# EAGLE design GBCART (EAGLE 6.4)
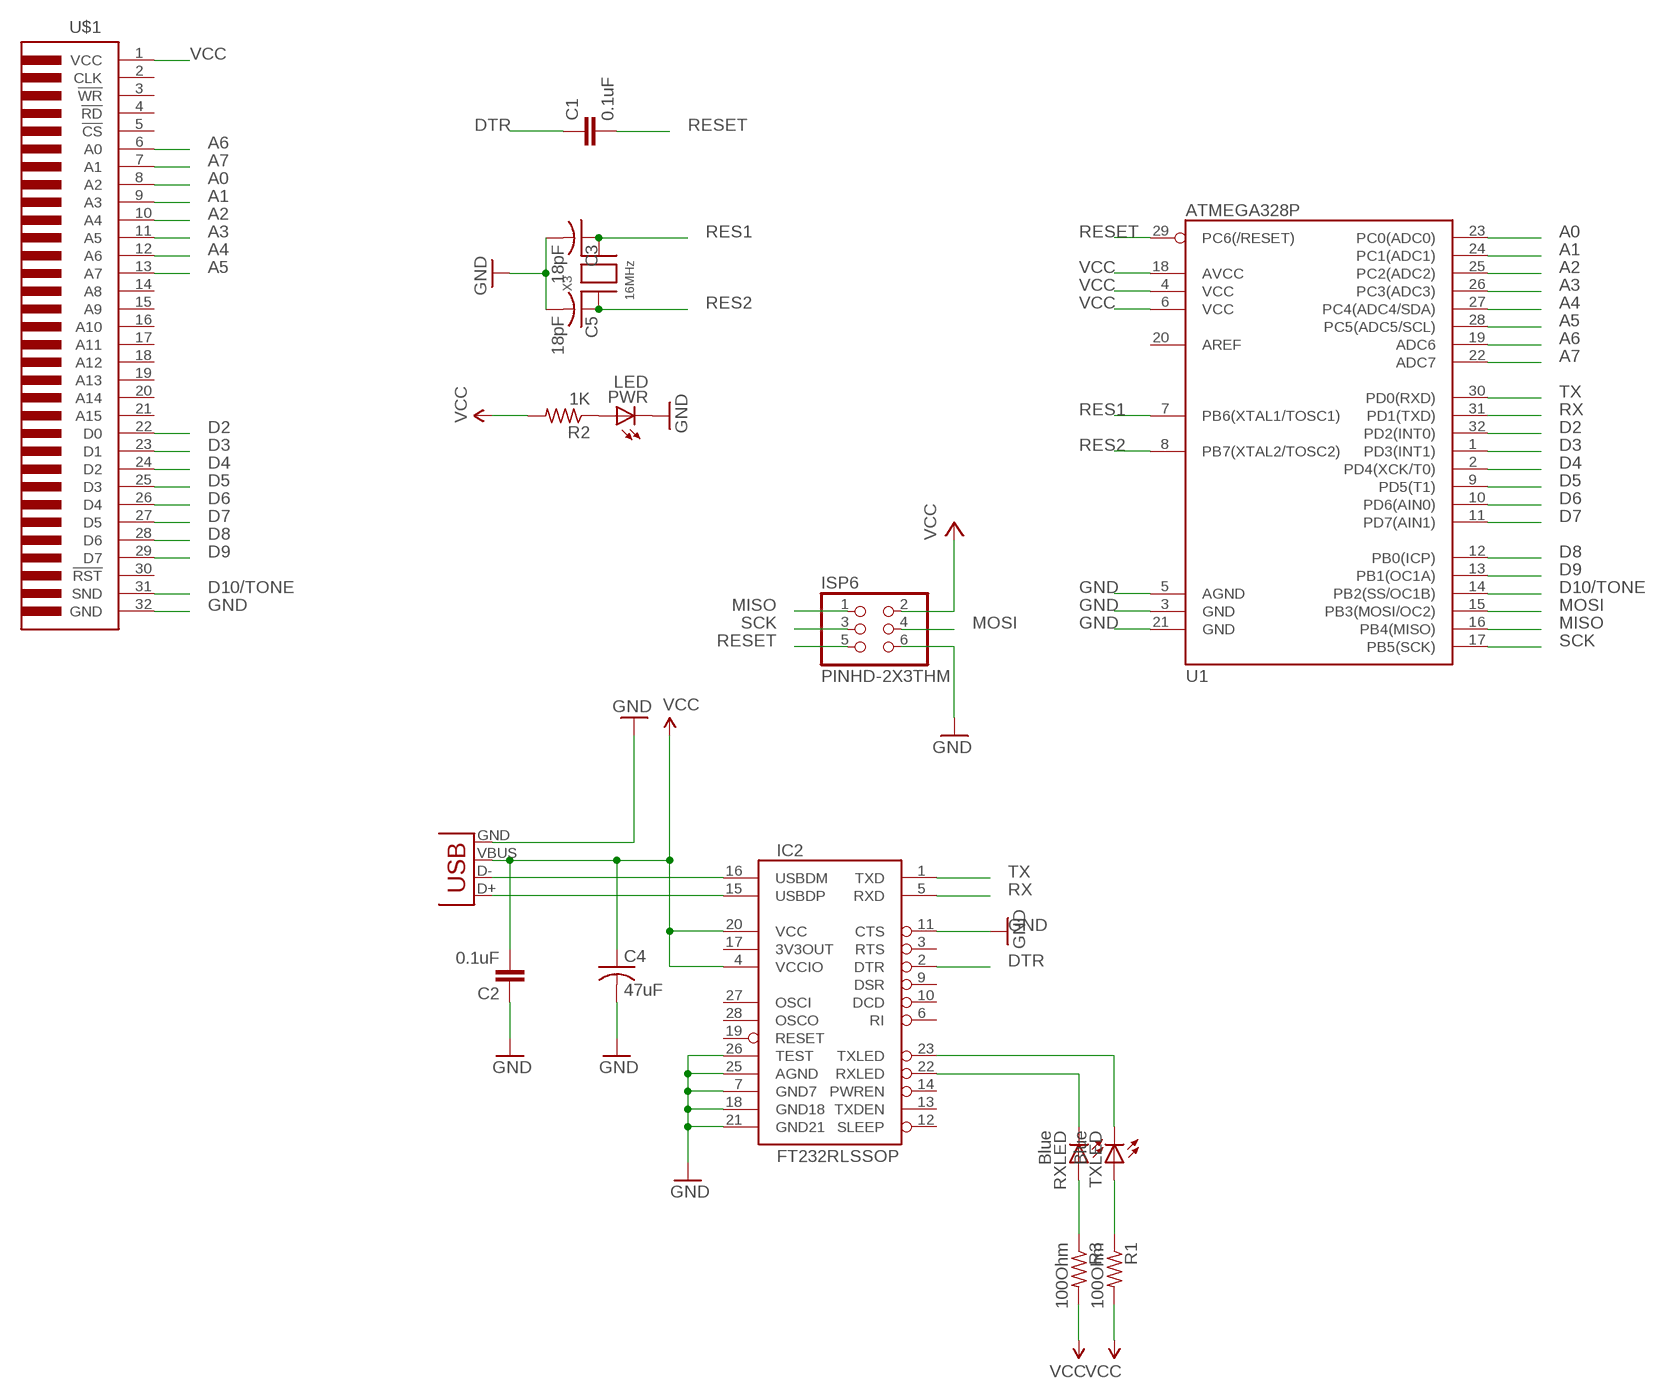
[diagram p0: schematic, sheet 1]

## Parts
C1  0.1uF  CAP0805  [0805]
C2  0.1uF  CAP0805  [0805]
C3  18pF  C-USC0805K  [C0805K]
C4  47uF  C-USC0805  [C0805]
C5  18pF  C-USC0805K  [C0805K]
IC2  FT232RLSSOP  [SSOP28DB]
ISP6  PINHD-2X3THM  [ISP6]
PWR  LED  LEDCHIPLED_0805  [CHIPLED_0805]
R1  100Ohm  R-US_R0805  [R0805]
R2  1K  R-US_R0805  [R0805]
R3  100Ohm  R-US_R0805  [R0805]
RXLED  Blue  LEDCHIPLED_0805  [CHIPLED_0805]
TXLED  Blue  LEDCHIPLED_0805  [CHIPLED_0805]
U1  ATMEGA328P  ATMEGA168  [TQFP32-08]
U$1  GBCART-FULL  [GBCART]
X1  USBSMD  [USB-MINIB]
X3  16MHz  XTALNX5032  [NX5032]

## Nets
A0: U1.23(PC0(ADC0)) U$1.8(A2)
A1: U1.24(PC1(ADC1)) U$1.9(A3)
A2: U1.25(PC2(ADC2)) U$1.10(A4)
A3: U1.26(PC3(ADC3)) U$1.11(A5)
A4: U1.27(PC4(ADC4/SDA)) U$1.12(A6)
A5: U1.28(PC5(ADC5/SCL)) U$1.13(A7)
A6: U1.19(ADC6) U$1.6(A0)
A7: U1.22(ADC7) U$1.7(A1)
D2: U1.32(PD2(INT0)) U$1.22(D0)
D3: U1.1(PD3(INT1)) U$1.23(D1)
D4: U1.2(PD4(XCK/T0)) U$1.24(D2)
D5: U1.9(PD5(T1)) U$1.25(D3)
D6: U1.10(PD6(AIN0)) U$1.26(D4)
D7: U1.11(PD7(AIN1)) U$1.27(D5)
D8: U1.12(PB0(ICP)) U$1.28(D6)
D9: U1.13(PB1(OC1A)) U$1.29(D7)
D10/TONE: U1.14(PB2(SS/OC1B)) U$1.31(SND)
D+: IC2.15(USBDP) X1.D+
D-: IC2.16(USBDM) X1.D-
DTR: C1.1 IC2.2(DTR)
GND: C2.1 C3.2 C4.2 C5.2 IC2.7(GND7) IC2.11(CTS) IC2.18(GND18) IC2.21(GND21) IC2.25(AGND) IC2.26(TEST) ISP6.6 PWR.C U1.3(GND) U1.5(AGND) U1.21(GND) U$1.32(GND) X1.GND
MISO: ISP6.1 U1.16(PB4(MISO))
MOSI: ISP6.4 U1.15(PB3(MOSI/OC2))
N$1: PWR.A R2.1
N$10: R3.1 RXLED.A
N$11: R1.1 TXLED.A
RES1: C3.1 U1.7(PB6(XTAL1/TOSC1)) X3.P$2
RES2: C5.1 U1.8(PB7(XTAL2/TOSC2)) X3.P$1
RESET: C1.2 ISP6.5 U1.29(PC6(/RESET))
RX: IC2.5(RXD) U1.31(PD1(TXD))
RXLED: IC2.22(RXLED) RXLED.C
SCK: ISP6.3 U1.17(PB5(SCK))
TX: IC2.1(TXD) U1.30(PD0(RXD))
TXLED: IC2.23(TXLED) TXLED.C
VCC: C2.2 C4.1 IC2.4(VCCIO) IC2.20(VCC) ISP6.2 R1.2 R2.2 R3.2 U1.4(VCC) U1.6(VCC) U1.18(AVCC) U$1.1(VCC) X1.VBUS
Unconnected: IC2.3(RTS) IC2.6(RI) IC2.9(DSR) IC2.10(DCD) IC2.12(SLEEP) IC2.13(TXDEN) IC2.14(PWREN) IC2.17(3V3OUT) IC2.19(RESET) IC2.27(OSCI) IC2.28(OSCO) U1.20(AREF) U$1.2(CLK) U$1.3(!WR) U$1.4(!RD) U$1.5(!CS) U$1.14(A8) U$1.15(A9) U$1.16(A10) U$1.17(A11) U$1.18(A12) U$1.19(A13) U$1.20(A14) U$1.21(A15) U$1.30(!RST)

## Library data of the parts
C1 C2 = SparkFun:CAP: Capacitor Standard 0603 ceramic capacitor, and 0.1" leaded capacitor.
C3 C5 = adafruit:C-US: CAPACITOR, American symbol
C4 = rcl:C-US: CAPACITOR, American symbol
IC2 = SparkFun:FT232RL: USB UART FT232RL 4th Generation USB UART (USB <-> Serial) Controller. Spark Fun Electronics SKU : COM-00650
ISP6 = adaprog:PINHD-2X3
PWR = adafruit:LED: LED
R1-R3 = adafruit:R-US_: RESISTOR, American symbol
RXLED TXLED = led:LED: LED
U1 = SparkFun:ATMEGA168
U$1 = gameboy:GBCART
X1 = SparkFun:USB: USB Connectors USB-B-PTH is fully proven SKU : PRT-00139 USB-miniB is fully proven SKU : PRT-00587 USB-A-PCB is untested. USB-A-H is throughly reviewed, but untested. Spark Fun Electronics SKU : PRT-00437 USB-B-SMT is throughly reviewed, but untested. Needs silkscreen touching up. USB-A-S has not been used/tested USB-MB-H has not been used/tested
X3 = adaprog:XTAL

## Board
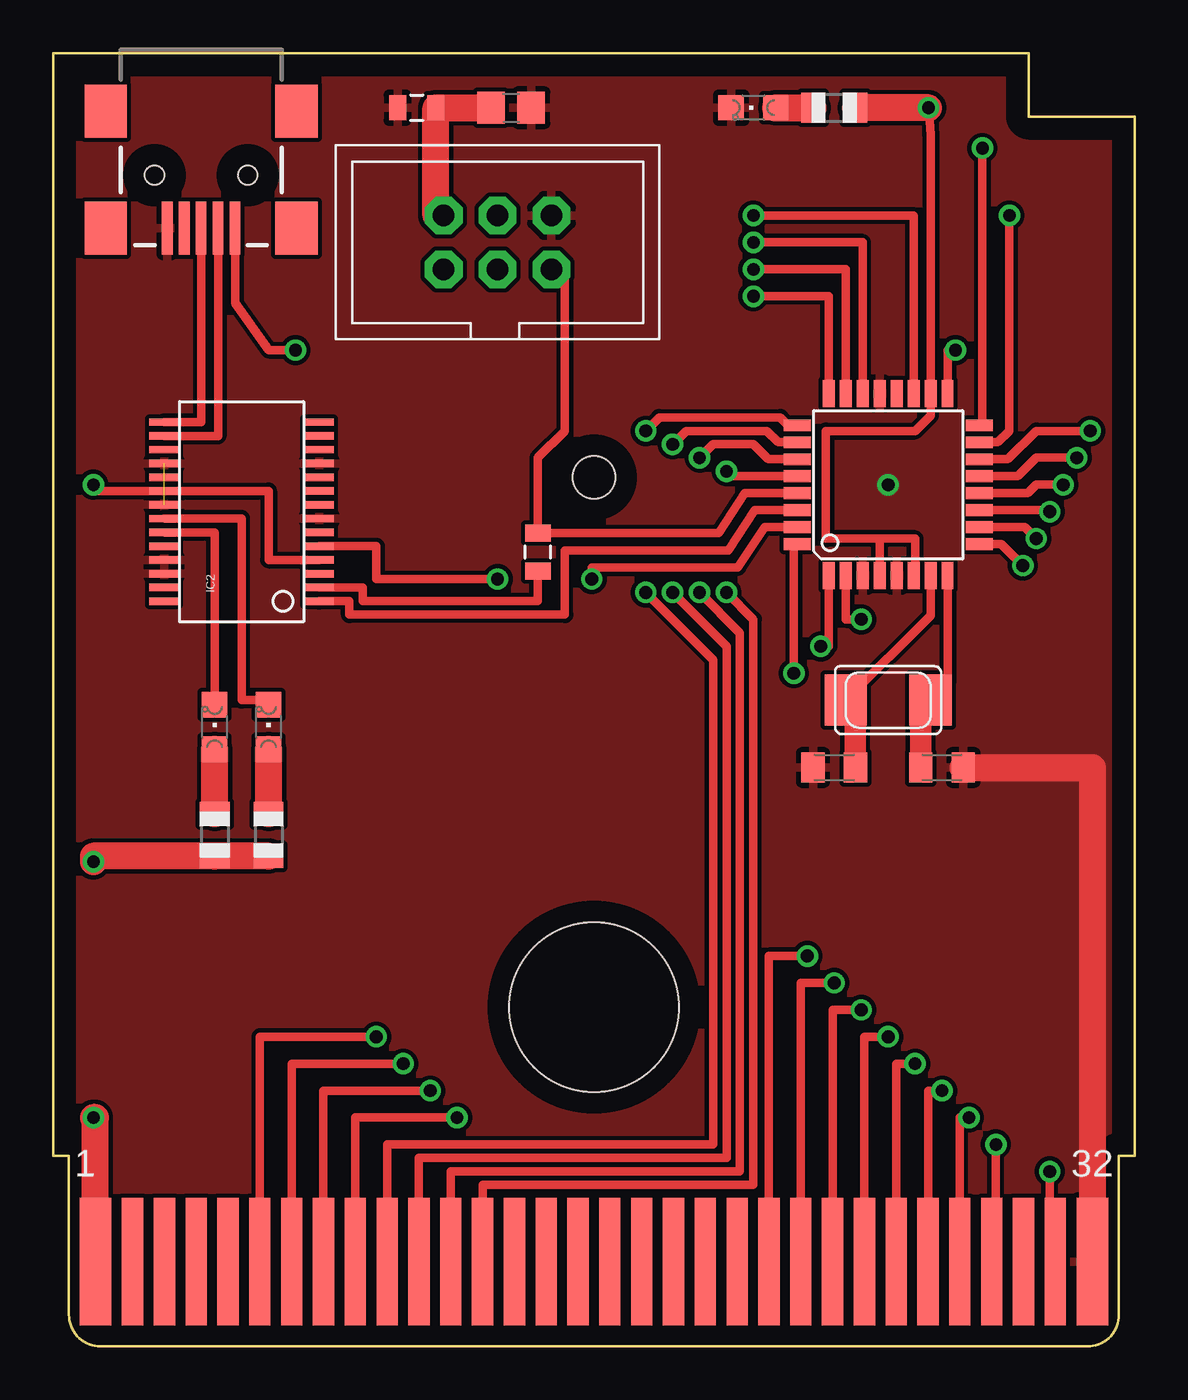
[diagram p1: board, top side]
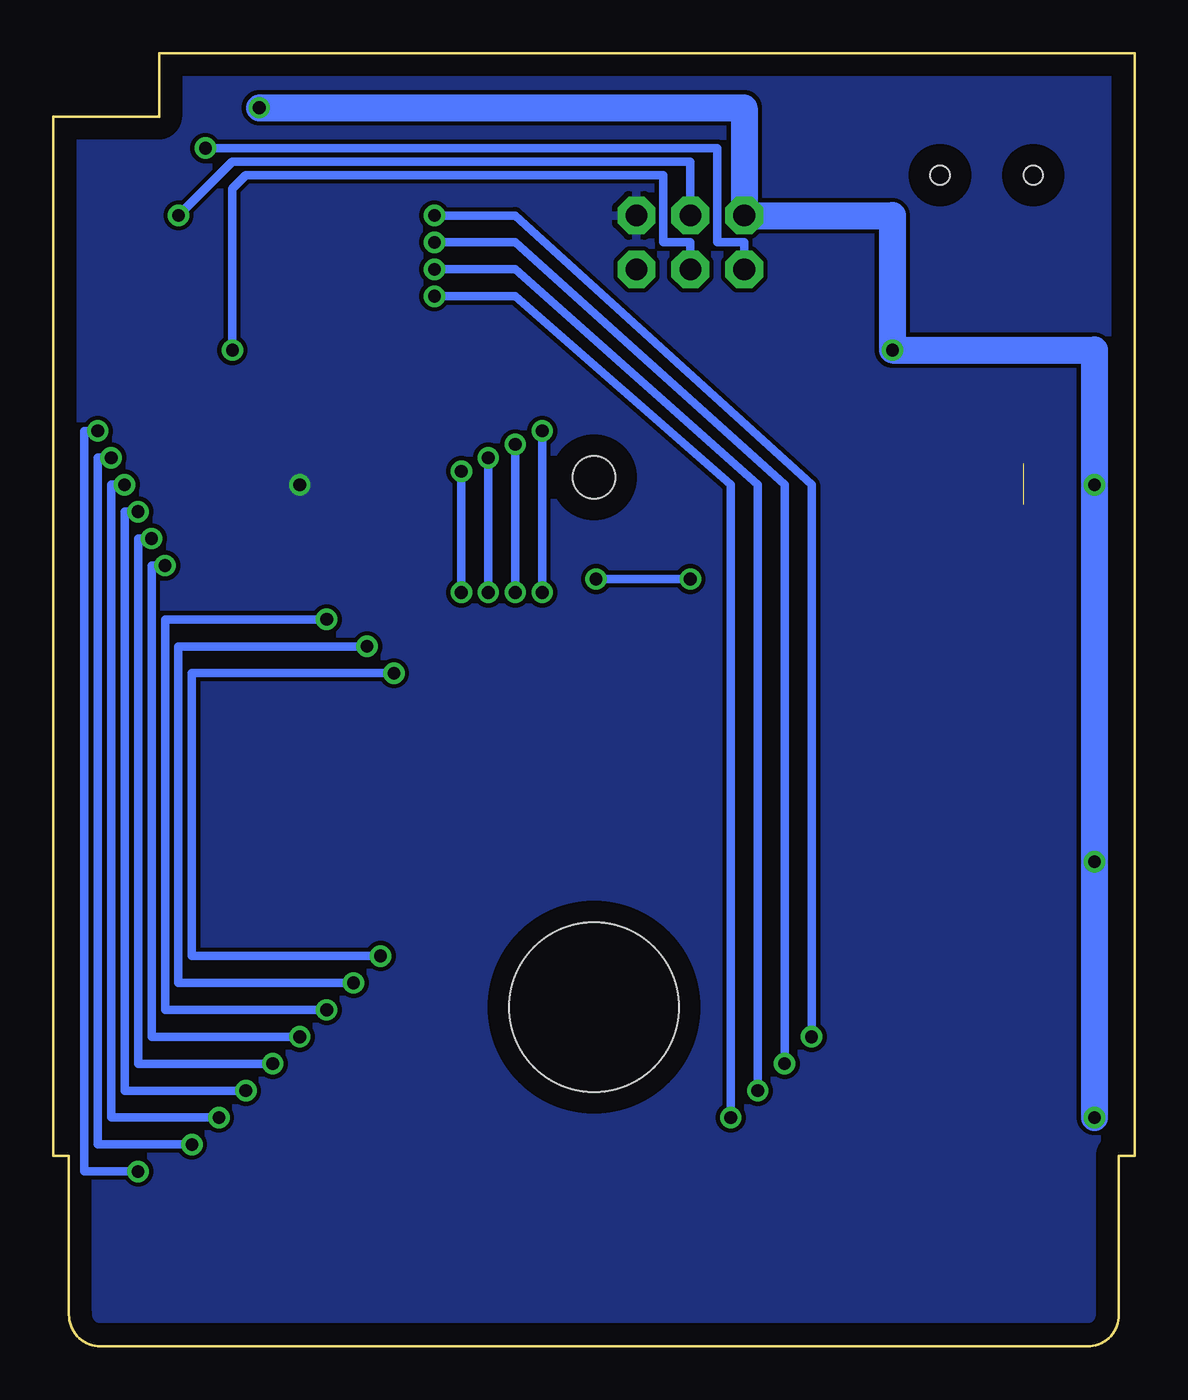
[diagram p2: board, bottom side, seen from below]

Size 51 x 61 mm. Coordinates in mm from the lower left corner, seen from the top.
Copper layers (1*16): Top 0.035mm / dielectric 1.5mm / Bottom 0.035mm
Design rules "default": minimum track width 10mil, minimum drill 24mil, track to track 8mil, track to pad 8mil, pad to pad 8mil, via to via 8mil, smd to smd 8mil, copper to edge 40mil, drill to drill 8mil, minimum pad ring 10mil, minimum via ring 8mil, stop-mask expansion 4mil, vias tented up to drill 0mil, thermal gap 10mil

### Footprints (pad centres in the part's own frame; a part is rotated, then mirrored left to right if it is on the bottom)
0805 = smd 0.8 x 1.2: 1 -0.9,0; 2 0.9,0
C0805K = smd 1.1 x 1.4: 1 -1,0; 2 1,0
C0805 = smd 1.3 x 1.5: 1 -0.95,0; 2 0.95,0
SSOP28DB = smd 0.348 x 1.397: 1 -4.225,-3.656; 2 -3.575,-3.656; 3 -2.925,-3.656; 4 -2.275,-3.656; 5 -1.625,-3.656; 6 -0.975,-3.656; 7 -0.325,-3.656; 8 0.325,-3.656; 9 0.975,-3.656; 10 1.625,-3.656; 11 2.275,-3.656; 12 2.925,-3.656; 13 3.575,-3.656; 14 4.225,-3.656; 15 4.225,3.656; 16 3.575,3.656; 17 2.925,3.656; 18 2.275,3.656; 19 1.625,3.656; 20 0.975,3.656; 21 0.325,3.656; 22 -0.325,3.656; 23 -0.975,3.656; 24 -1.625,3.656; 25 -2.275,3.656; 26 -2.925,3.656; 27 -3.575,3.656; 28 -4.225,3.656
ISP6 = drill 1.016 pad 1.778 octagon: 1 -2.54,-1.27; 2 -2.54,1.27; 3 0,-1.27; 4 0,1.27; 5 2.54,-1.27; 6 2.54,1.27
CHIPLED_0805 = smd 1.2 x 1.2: A 0,-1.05; C 0,1.05
R0805 = smd 1.1 x 1.4: 1 -1,0; 2 1,0
TQFP32-08 = smd 1.27 x 0.559: 1 -4.293,2.8; 2 -4.293,2; 3 -4.293,1.2; 4 -4.293,0.4; 5 -4.293,-0.4; 6 -4.293,-1.2; 7 -4.293,-2; 8 -4.293,-2.8; 17 4.293,-2.8; 18 4.293,-2; 19 4.293,-1.2; 20 4.293,-0.4; 21 4.293,0.4; 22 4.293,1.2; 23 4.293,2; 24 4.293,2.8 | smd 0.559 x 1.27: 9 -2.8,-4.293; 10 -2,-4.293; 11 -1.2,-4.293; 12 -0.4,-4.293; 13 0.4,-4.293; 14 1.2,-4.293; 15 2,-4.293; 16 2.8,-4.293; 25 2.8,4.293; 26 2,4.293; 27 1.2,4.293; 28 0.4,4.293; 29 -0.4,4.293; 30 -1.2,4.293; 31 -2,4.293; 32 -2.8,4.293
GBCART = smd 1.5 x 6: 1 -23.4,-25.21; 32 23.6,-25.21 | smd 1 x 6: 2 -21.65,-25.21; 3 -20.15,-25.21; 4 -18.65,-25.21; 5 -17.15,-25.21; 6 -15.65,-25.21; 7 -14.15,-25.21; 8 -12.65,-25.21; 9 -11.15,-25.21; 10 -9.65,-25.21; 11 -8.15,-25.21; 12 -6.65,-25.21; 13 -5.15,-25.21; 14 -3.65,-25.21; 15 -2.15,-25.21; 16 -0.65,-25.21; 17 0.85,-25.21; 18 2.35,-25.21; 19 3.85,-25.21; 20 5.35,-25.21; 21 6.85,-25.21; 22 8.35,-25.21; 23 9.85,-25.21; 24 11.35,-25.21; 25 12.85,-25.21; 26 14.35,-25.21; 27 15.85,-25.21; 28 17.35,-25.21; 29 18.85,-25.21; 30 20.35,-25.21; 31 21.85,-25.21 | hole 8: 0.1,-13.21 | hole 2: 0.1,11.79
USB-MINIB = smd 2.5 x 0.5: D+ 2.5,0; D- 2.5,0.8; GND 2.5,-1.6; ID 2.5,-0.8; VBUS 2.5,1.6 | smd 2.5 x 2: GND@1 -3,-4.5; GND@2 -3,4.5; GND@3 2.5,4.5; GND@4 2.5,-4.5 | hole 0.9: 0,2.2; 0,-2.2
NX5032 = smd 2 x 2.4: P$1 2,0; P$2 -2,0

### Placement (x,y rotation side)
C1  22.86,37.47 90 top
C2  17.14,58.42 0 top
C3  36.83,27.3 180 top
C4  21.59,58.42 0 top
C5  41.91,27.3 0 top
IC2  8.89,39.37 90 top
ISP6  20.95,52.07 0 top
PWR  33.02,58.42 90 top
R1  7.62,24.13 270 top
R2  36.83,58.42 0 top
R3  10.16,24.13 270 top
RXLED  10.16,29.21 0 top
TXLED  7.62,29.21 0 top
U1  39.37,40.64 90 top
U$1  25.4,29.21 0 top
X1  6.99,55.24 270 top
X3  39.37,30.48 0 top

### Tracks (layer width: path | path; a pad name or v marks a point on that pad's centre or on a via)
A0  (via drill 0.6)
  Top 0.406: U1.23 37.37,50.8 v33.02,50.8 | v17.78,12.06 12.75,12.06 U$1.8
  Bottom 0.406: v33.02,50.8 29.21,50.8 17.78,40.64 v17.78,12.06
A1  (via drill 0.6)
  Top 0.406: U1.24 36.57,49.53 v33.02,49.53 | v19.05,10.79 14.25,10.79 U$1.9
  Bottom 0.406: v33.02,49.53 29.21,49.53 19.05,40.64 v19.05,10.79
A2  (via drill 0.6)
  Top 0.406: U$1.10 15.75,9.53 31.11,9.53 31.11,32.38 v27.94,35.56 | v27.94,43.18 28.57,43.81 34.29,43.81 34.66,43.44 U1.25
  Bottom 0.406: v27.94,35.56 v27.94,43.18
A3  (via drill 0.6)
  Top 0.406: U$1.11 17.25,8.89 31.75,8.89 31.75,33.02 v29.21,35.56 | v29.21,42.55 29.84,43.18 33.66,43.18 34.2,42.64 U1.26
  Bottom 0.406: v29.21,35.56 v29.21,42.55
A4  (via drill 0.6)
  Top 0.406: U$1.12 18.75,8.26 32.38,8.26 32.38,33.66 v30.48,35.56 | v30.48,41.91 31.11,42.55 33.02,42.55 33.73,41.84 U1.27
  Bottom 0.406: v30.48,35.56 v30.48,41.91
A5  (via drill 0.6)
  Top 0.406: U$1.13 20.25,7.62 33.02,7.62 33.02,34.29 v31.75,35.56 | v31.75,41.27 31.98,41.04 U1.28
  Bottom 0.406: v31.75,35.56 v31.75,41.27
A6  (via drill 0.6)
  Top 0.406: U1.19 40.57,53.34 v33.02,53.34 | v15.24,14.61 9.75,14.61 U$1.6
  Bottom 0.406: v33.02,53.34 29.21,53.34 15.24,40.64 v15.24,14.61
A7  (via drill 0.6)
  Top 0.406: U1.22 38.17,52.07 v33.02,52.07 | v16.51,13.34 11.25,13.34 U$1.7
  Bottom 0.406: v33.02,52.07 29.21,52.07 16.51,40.64 v16.51,13.34
D2  (via drill 0.6)
  Top 0.406: U1.32 34.92,37.84 v34.92,31.75 | v35.56,18.41 33.75,18.41 U$1.22
  Bottom 0.406: v34.92,31.75 44.45,31.75 44.45,18.41 v35.56,18.41
D3  (via drill 0.6)
  Top 0.406: U1.1 36.57,33.02 v36.2,33.02 | v36.83,17.14 35.25,17.14 U$1.23
  Bottom 0.406: v36.2,33.02 45.09,33.02 45.09,17.14 v36.83,17.14
D4  (via drill 0.6)
  Top 0.406: U1.2 37.37,34.29 v38.1,34.29 | v38.1,15.88 36.75,15.88 U$1.24
  Bottom 0.406: v38.1,34.29 45.72,34.29 45.72,15.88 v38.1,15.88
D5  (via drill 0.6)
  Top 0.406: U1.9 44.71,37.84 v45.72,36.83 | U$1.25 38.25,14.61 v39.37,14.61
  Bottom 0.406: v39.37,14.61 46.35,14.61 46.35,36.83 v45.72,36.83
D6  (via drill 0.6)
  Top 0.406: U1.10 45.81,38.64 v46.35,38.1 | U$1.26 39.75,13.34 v40.64,13.34
  Bottom 0.406: v40.64,13.34 46.99,13.34 46.99,38.1 v46.35,38.1
D7  (via drill 0.6)
  Top 0.406: U1.11 46.92,39.44 v46.99,39.37 | U$1.27 41.25,12.06 v41.91,12.06
  Bottom 0.406: v41.91,12.06 47.62,12.06 47.62,39.37 v46.99,39.37
D8  (via drill 0.6)
  Top 0.406: U1.12 45.95,40.24 46.35,40.64 v47.62,40.64 | U$1.28 42.75,10.79 v43.18,10.79
  Bottom 0.406: v43.18,10.79 48.26,10.79 48.26,40.64 v47.62,40.64
D9  (via drill 0.6)
  Top 0.406: U1.13 45.48,41.04 46.35,41.91 v48.26,41.91 | U$1.29 44.45,4 v44.45,9.53
  Bottom 0.406: v44.45,9.53 48.9,9.53 48.9,41.91 v48.26,41.91
D10/TONE  (via drill 0.6)
  Top 0.406: U1.14 45.02,41.84 46.35,43.18 v48.9,43.18 | U$1.31 46.99,4 v46.99,8.26
  Bottom 0.406: v46.99,8.26 49.53,8.26 49.53,43.18 v48.9,43.18
D+
  Top 0.406: X1.D+ 6.99,43.59 IC2.15
D-
  Top 0.406: X1.D- 7.79,42.95 IC2.16
DTR
  Top 0.406: C1.1 22.86,35.16 14.61,35.16 14.61,35.8 IC2.2
GND  (via drill 0.6)  (1 unrouted)
  Top 1.27: C5.2 49,27.3 U$1.32
  other vias: 39.37,40.64
  pour Top: 0,60.96 0,0 52.07,0 52.07,60.96
  pour Bottom: 0,60.96 52.07,60.96 52.07,0 0,0
MISO  (via drill 0.6)
  Top 0.406: v43.81,56.52 43.81,43.59 U1.16
  Bottom 0.406: ISP6.1 18.41,52.07 19.68,52.07 19.68,56.52 v43.81,56.52
MOSI  (via drill 0.6)
  Top 0.406: v45.09,53.34 45.09,43.18 44.55,42.64 U1.15
  Bottom 0.406: ISP6.4 20.95,55.88 42.55,55.88 v45.09,53.34
N$1
  Top 1.27: PWR.A R2.1
N$2  (via drill 0.6)
  other vias: 11.43,46.99
N$10
  Top 1.27: R3.1 RXLED.A
N$11
  Top 1.27: R1.1 TXLED.A
RES1
  Top 0.406: U1.7 41.37,34.48 X3.P$2
  Top 1.016: C3.1 37.83,30.02 X3.P$2
RES2
  Top 0.406: U1.8 42.17,31.28 X3.P$1
  Top 1.016: C5.1 40.91,30.02 X3.P$1
RESET
  Top 0.406: ISP6.5 24.13,50.8 24.13,43.18 22.86,41.91 C1.2 31.38,38.37 32.62,40.24 U1.29 35.08,40.27
RX  (via drill 0.6)
  Top 0.406: IC2.5 15.24,37.74 15.24,36.2 v20.95,36.2 | v25.4,36.2 25.4,36.73 32.29,36.73 33.56,38.64 U1.31
  Bottom 0.406: v20.95,36.2 v25.4,36.2
RXLED
  Top 0.406: RXLED.C 10.16,30.48 8.89,30.48 8.89,39.05 IC2.22
SCK  (via drill 0.6)
  Top 0.406: v42.55,46.99 42.17,46.99 U1.17
  Bottom 0.406: ISP6.3 20.95,52.07 22.23,52.07 22.23,55.24 41.91,55.24 42.55,54.61 v42.55,46.99
TX
  Top 0.406: U1.30 33.09,39.44 31.82,37.53 24.13,37.53 24.13,34.51 13.97,34.51 13.97,35.15 IC2.1
TXLED
  Top 0.406: TXLED.C 7.62,38.4 IC2.23
VCC  (via drill 0.6)
  Top 0.406: X1.VBUS 8.59,49.2 10.16,46.99 v11.43,46.99 | v1.91,40.64 1.91,40.34 IC2.20 10.16,40.34 10.16,37.09 IC2.4 | U1.6 40.64,36.35 40.64,38.1 38.97,38.1 | 38.97,38.1 36.43,38.1 36.43,43.18 40.64,43.18 41.37,43.91 U1.18 41.37,57.15 v41.27,58.42 | U1.4 38.97,38.1
  Top 1.27: ISP6.2 18.05,53.34 C2.2 C4.1 | R3.2 R1.2 1.91,23.13 v1.91,22.86 | U$1.1 2,10.79 v1.91,10.79 | v41.27,58.42 R2.2
  Bottom 1.27: v1.91,10.79 v1.91,22.86 v1.91,40.64 1.91,46.99 v11.43,46.99 11.43,53.34 ISP6.2 18.41,58.42 v41.27,58.42